# EAGLE design RxDuino_Rev4b (EAGLE 6.0)
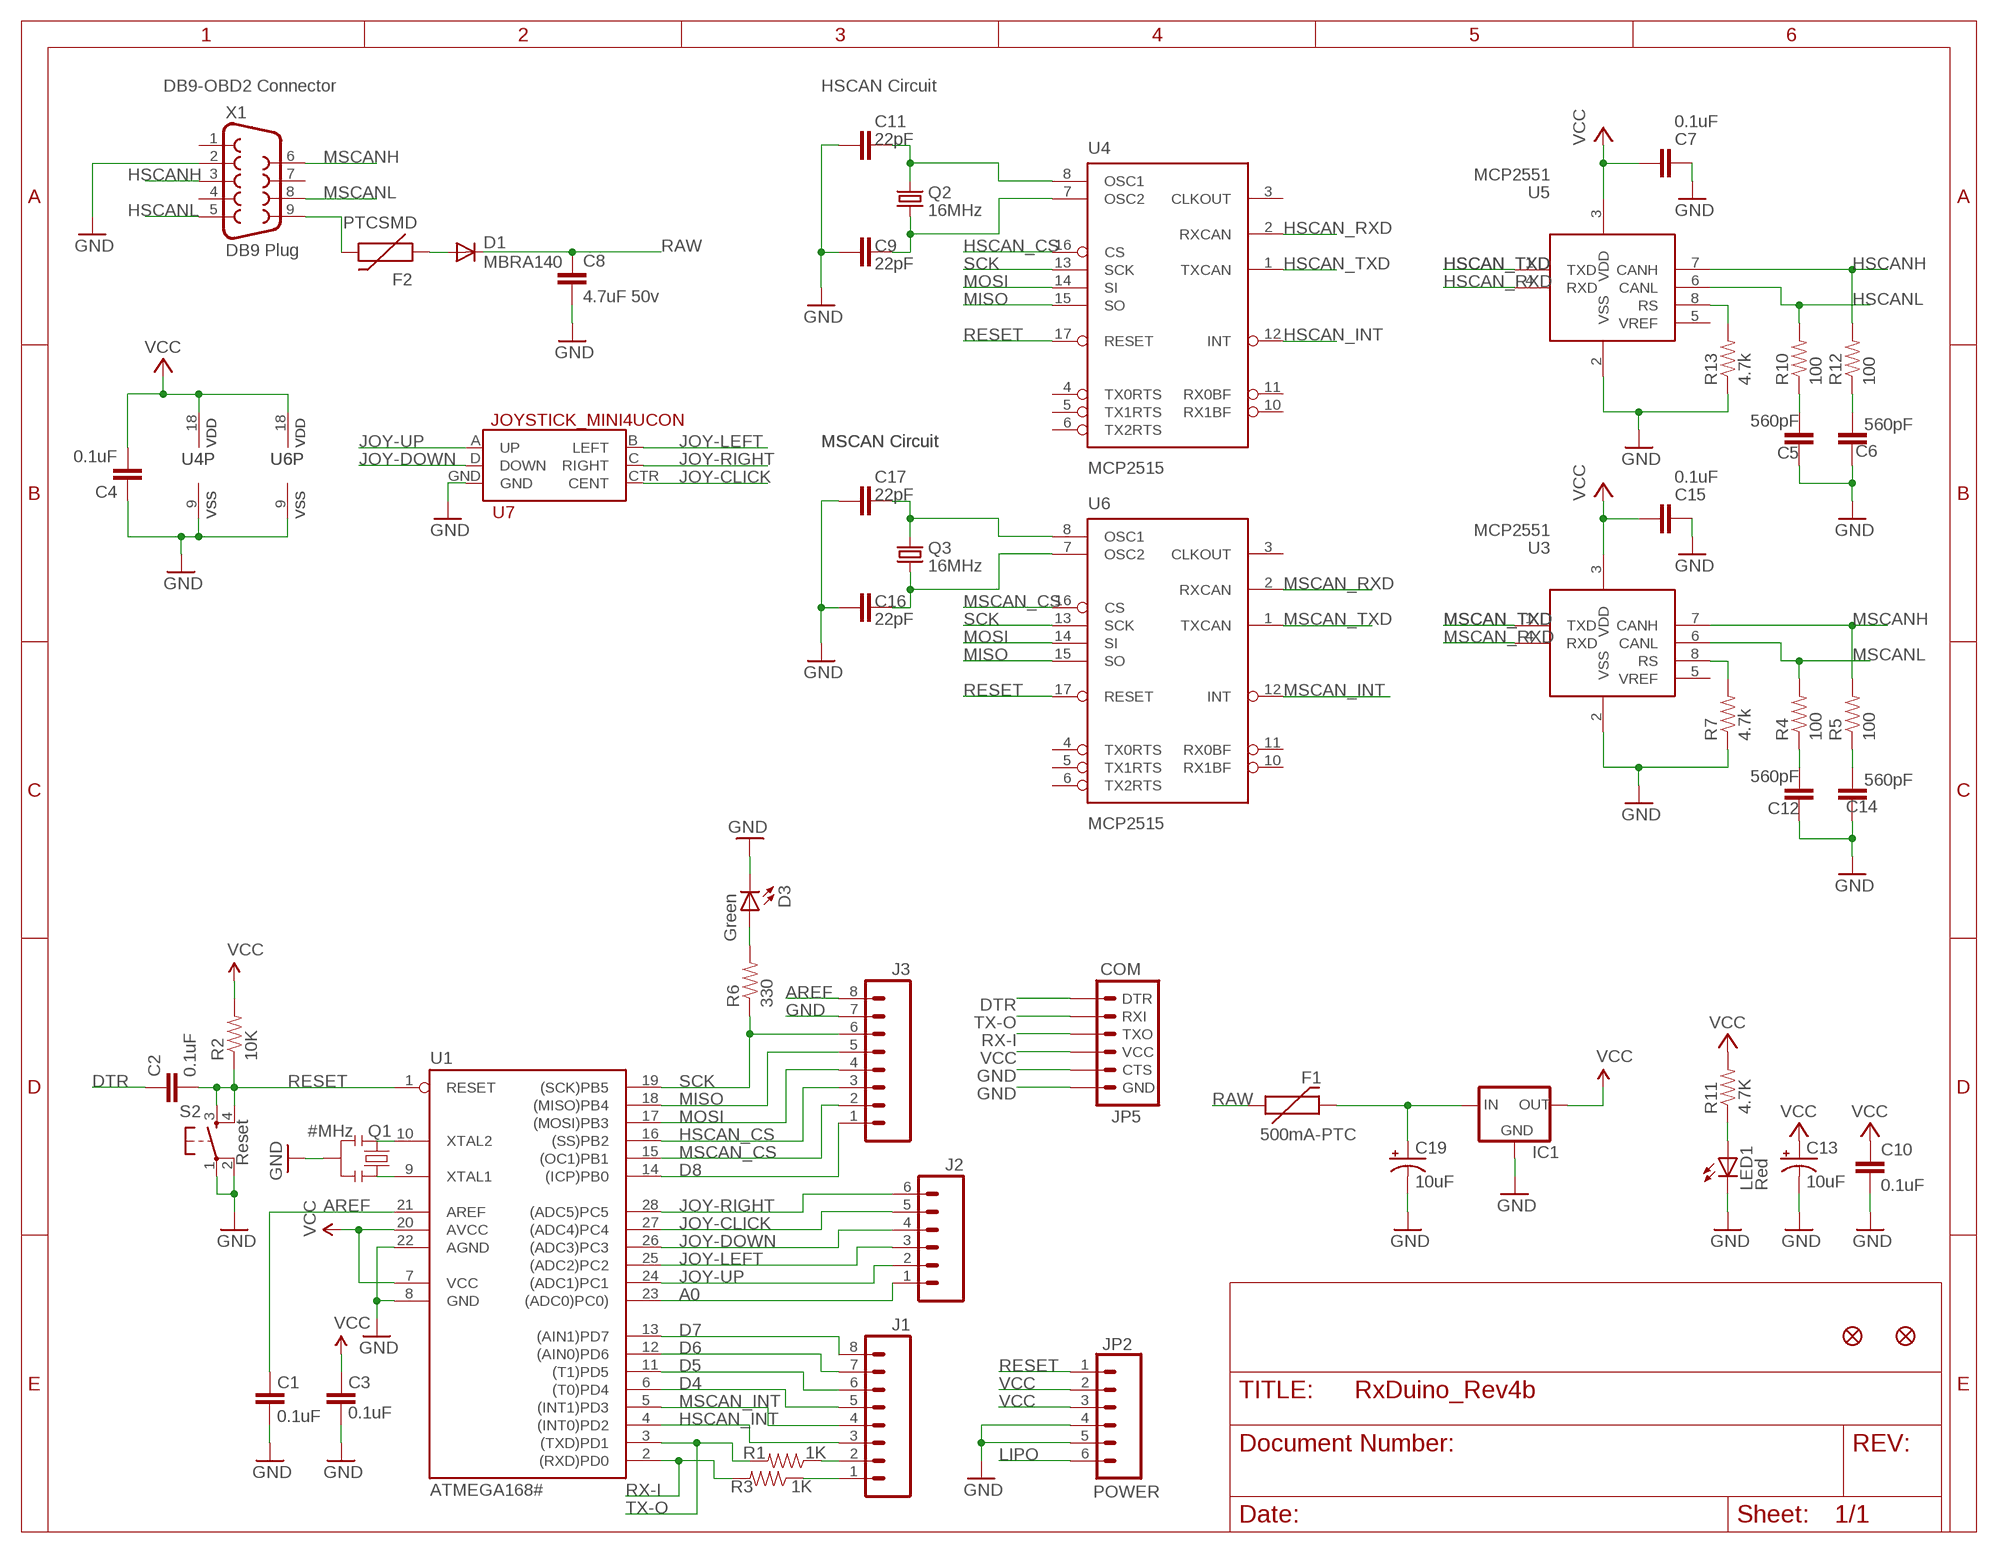
[diagram p0: schematic, sheet 1]

## Parts
C1  0.1uF  CAP1206  [1206]
C2  0.1uF  CAP1206  [1206]
C3  0.1uF  CAP1206  [1206]
C4  0.1uF  CAP1206  [1206]
C5  560pF  CAP1206  [1206]
C6  560pF  CAP1206  [1206]
C7  0.1uF  CAP1206  [1206]
C8  4.7uF 50v  CAP1206  [1206]
C9  22pF  CAP1206  [1206]
C10  0.1uF  CAP1206  [1206]
C11  22pF  CAP1206  [1206]
C12  560pF  CAP1206  [1206]
C13  10uF  CAP_POLE  [PANASONIC_E]
C14  560pF  CAP1206  [1206]
C15  0.1uF  CAP1206  [1206]
C16  22pF  CAP1206  [1206]
C17  22pF  CAP1206  [1206]
C19  10uF  CAP_POLE  [PANASONIC_E]
D1  MBRA140  DIODESMA  [SMA-DIODE]
D3  Green  LED1206  [LED-1206]
F1  500mA-PTC  PTCSMD  [PTC-1206]
F2  PTCSMD  [PTC-1206]
IC1  V_REG_78XX-TO-220  [TO-220-ALT]
J1  M08  [1X08]
J2  M06SIP  [1X06]
J3  M08  [1X08]
JP2  POWER  M06SIP  [1X06]
JP5  COM  ARDUINO_SERIAL_PROGRAMPTH  [1X06]
LED1  Red  LED1206  [LED-1206]
Q1  #MHz  RESONATORPTH  [RESONATOR-PTH]
Q2  16MHz  CRYSTALHC49US  [HC49US]
Q3  16MHz  CRYSTALHC49US  [HC49US]
R1  1K  RESISTOR1206  [1206]
R2  10K  RESISTOR1206  [1206]
R3  1K  RESISTOR1206  [1206]
R4  100  RESISTOR1206  [1206]
R5  100  RESISTOR1206  [1206]
R6  330  RESISTOR1206  [1206]
R7  4.7k  RESISTOR1206  [1206]
R10  100  RESISTOR1206  [1206]
R11  4.7K  RESISTOR1206  [1206]
R12  100  RESISTOR1206  [1206]
R13  4.7k  RESISTOR1206  [1206]
S2  Reset  TAC_SWITCHSND  [TACTILE_SWITCH_SMD]
U1  ATMEGA168#  AT90S4433P  [DIL28-3]
U3  MCP2551  [SO-08M]
U4  MCP2515  MCP2510SO  [SO-18W]
U5  MCP2551  [SO-08M]
U6  MCP2515  MCP2510SO  [SO-18W]
U7  JOYSTICK_MINI4UCON  [JOYSTICK_MINI]
U$2  FIDUCIAL1X2  [FIDUCIAL-1X2]
U$4  FIDUCIAL1X2  [FIDUCIAL-1X2]
X1  DB9 Plug  DB9MALE  [DB9_MALE]

## Nets
A0: J2.1 U1.23((ADC0)PC0))
AREF: C1.2 J3.8 U1.21(AREF)
D1R: D1.A F2.1
D3N: D3.A R6.2
D4: J1.5 U1.6((T0)PD4)
D5: J1.6 U1.11((T1)PD5)
D6: J1.7 U1.12((AIN0)PD6)
D7: J1.8 U1.13((AIN1)PD7)
D8: J3.1 U1.14((ICP)PB0)
DTR: C2.1 JP5.1(DTR)
GND [vcc]: C1.1 C3.1 C4.1 C5.1 C6.1 C7.1 C8.2 C9.1 C10.2 C11.1 C12.1 C13.- C14.1 C15.1 C16.1 C17.1 C19.- D3.C IC1.GND J3.7 JP2.4 JP2.5 JP5.5(CTS) JP5.6(GND) LED1.C Q1.2 R7.1 R13.1 S2.1 S2.2 U1.8(GND) U1.22(AGND) U3.2(VSS) U4.9(VSS) U5.2(VSS) U6.9(VSS) U7.GND X1.2
HSCAN_CS: J3.3 U1.16((SS)PB2) U4.16(CS)
HSCAN_INT: J1.3 U1.4((INT0)PD2) U4.12(INT)
HSCAN_RXD: U4.2(RXCAN) U5.4(RXD)
HSCAN_TXD: U4.1(TXCAN) U5.1(TXD)
HSCANH: R12.2 U5.7(CANH) X1.3
HSCANL: R10.2 U5.6(CANL) X1.5
HSQ1: C11.2 Q2.2 U4.8(OSC1)
HSQ2: C9.2 Q2.1 U4.7(OSC2)
HSRS: R13.2 U5.8(RS)
JOY-CLICK: J2.5 U1.27((ADC4)PC4) U7.CTR(CENT)
JOY-DOWN: J2.4 U1.26((ADC3)PC3) U7.D(DOWN)
JOY-LEFT: J2.3 U1.25((ADC2)PC2) U7.B(LEFT)
JOY-RIGHT: J2.6 U1.28((ADC5)PC5) U7.C(RIGHT)
JOY-UP: J2.2 U1.24((ADC1)PC1) U7.A(UP)
LIPO: JP2.6
MEGAP9: Q1.3 U1.9(XTAL1)
MEGAP10: Q1.1 U1.10(XTAL2)
MISO: J3.5 U1.18((MISO)PB4) U4.15(SO) U6.15(SO)
MOSI: J3.4 U1.17((MOSI)PB3) U4.14(SI) U6.14(SI)
MSCAN_CS: J3.2 U1.15((OC1)PB1) U6.16(CS)
MSCAN_INT: J1.4 U1.5((INT1)PD3) U6.12(INT)
MSCAN_RXD: U3.4(RXD) U6.2(RXCAN)
MSCAN_TXD: U3.1(TXD) U6.1(TXCAN)
MSCANH: R5.2 U3.7(CANH) X1.6
MSCANL: R4.2 U3.6(CANL) X1.8
MSQ1: C17.2 Q3.2 U6.8(OSC1)
MSQ2: C16.2 Q3.1 U6.7(OSC2)
MSRS: R7.2 U3.8(RS)
PTCN: F2.2 X1.9
R4N: C12.2 R4.1
R5N: C14.2 R5.1
R10N: C5.2 R10.1
R11N: LED1.A R11.1
R12N: C6.2 R12.1
RAW [vcc]: C8.1 D1.C F1.1
RAWN: C19.+ F1.2 IC1.IN
RESET: C2.2 JP2.1 R2.1 S2.3 S2.4 U1.1(RESET) U4.17(RESET) U6.17(RESET)
RX-I: JP5.3(TXO) R3.2 U1.2((RXD)PD0)
RX-IP: J1.2 R1.1
SCK: J3.6 R6.1 U1.19((SCK)PB5) U4.13(SCK) U6.13(SCK)
TX-O: JP5.2(RXI) R1.2 U1.3((TXD)PD1)
TX-OP: J1.1 R3.1
VCC [vcc]: C3.2 C4.2 C7.2 C10.1 C13.+ C15.2 IC1.OUT JP2.2 JP2.3 JP5.4(VCC) R2.2 R11.2 U1.7(VCC) U1.20(AVCC) U3.3(VDD) U4.18(VDD) U5.3(VDD) U6.18(VDD)
Unconnected: U3.5(VREF) U4.3(CLKOUT) U4.4(TX0RTS) U4.5(TX1RTS) U4.6(TX2RTS) U4.10(RX1BF) U4.11(RX0BF) U5.5(VREF) U6.3(CLKOUT) U6.4(TX0RTS) U6.5(TX1RTS) U6.6(TX2RTS) U6.10(RX1BF) U6.11(RX0BF) X1.1 X1.4 X1.7

## Notes on the sheet
- DB9-OBD2 Connector | HSCAN Circuit
- MSCAN Circuit | MSCAN Circuit

## Library data of the parts
C1-C12 C14-C17 = SparkFun:CAP: Capacitor Standard 0603 ceramic capacitor, and 0.1" leaded capacitor.
C13 C19 = SparkFun:CAP_POL: Capacitor Polarized These are standard SMD and PTH capacitors. Normally 10uF, 47uF, and 100uF in electrolytic and tantalum varieties. Always verify the external diameter of the through hole cap, it varies with capacity, voltage, and manufacturer. The EIA devices should be standard.
D1 = SparkFun:DIODE: Diode These are standard reverse protection diodes and small signal diodes. SMA package can handle up to about 1A. SOD-323 can handle about 200mA. What the SOD-323 package when ordering, there are some mfgs out there that are 5-pin packages.
D3 LED1 = SparkFun:LED: LEDs Standard schematic elements and footprints for 5mm, 3mm, 1206, and 0603 sized LEDs. 5mm - Spark Fun Electronics SKU : COM-00529 (and others)
F1 F2 = SparkFun:PTC: Resettable Fuse PTC Resettable Fuse. Spark Fun Electronics SKU : COM-08357
IC1 = SparkFun:V_REG_78XX: Voltage Regulator Standard 7805 5V regulator. IGO (Input Ground Output). Spark Fun Electronics SKU : COM-00107
J1 J3 = SparkFun:M08: Header 8 Standard 8-pin 0.1" header. Use with straight break away headers (SKU : PRT-00116), right angle break away headers (PRT-00553), swiss pins (PRT-00743), machine pins (PRT-00117), and female headers (PRT-00115).
J2 JP2 = SparkFun:M06: Header 6 Standard 6-pin 0.1" header. Use with straight break away headers (SKU : PRT-00116), right angle break away headers (PRT-00553), swiss pins (PRT-00743), machine pins (PRT-00117), and female headers (PRT-00115). Molex polarized connector foot print use with SKU : PRT-08094 with associated crimp pins and housings.
JP5 = SparkFun:ARDUINO_SERIAL_PROGRAM
Q1 = SparkFun:RESONATOR: Resonator Small SMD resonator. This is the itty bitty 10/20MHz resonators with built in caps. CSTCE10M0G55 and CSTCE20M0V53. Footprint has been reviewed closely but hasn't been tested yet.
Q2 Q3 = SparkFun:CRYSTAL: Crystals Various standard crystals. Proven footprints. Spark Fun Electronics SKU : COM-00534
R1-R7 R10-R13 = SparkFun:RESISTOR: Resistor Basic schematic elements and footprints for 0603, 1206, and PTH resistors.
S2 = SparkFun:TAC_SWITCH: Momentary Switch Button commonly used for reset or general input. Spark Fun Electronics SKU : COM-00097
U1 = atmel:AT90S4433: MICROCONTROLLER 4 Kbytes FLASH 128 bytes SRAM 256 bytes EEPROM UART 6-channel 10 bit ADC
U3 U5 = skpang_lib:MCP2551
U4 U6 = microchip_can:MCP2510
U7 = SparkFun:JOYSTICK_MINI
U$2 U$4 = SparkFun:FIDUCIAL: Fiducial Alignment Points Various fiducial points for machine vision alignment.
X1 = SparkFun:DB9: DB9 Connector Standard DB9 (D-Sub 9) serial connector. Can be used for CAN bus as well as RS485 and RS232. Footprint production proven. Spark Fun Electronics SKU : PRT-00429

## Net classes
1 vcc: width 0.203 mm

## Board
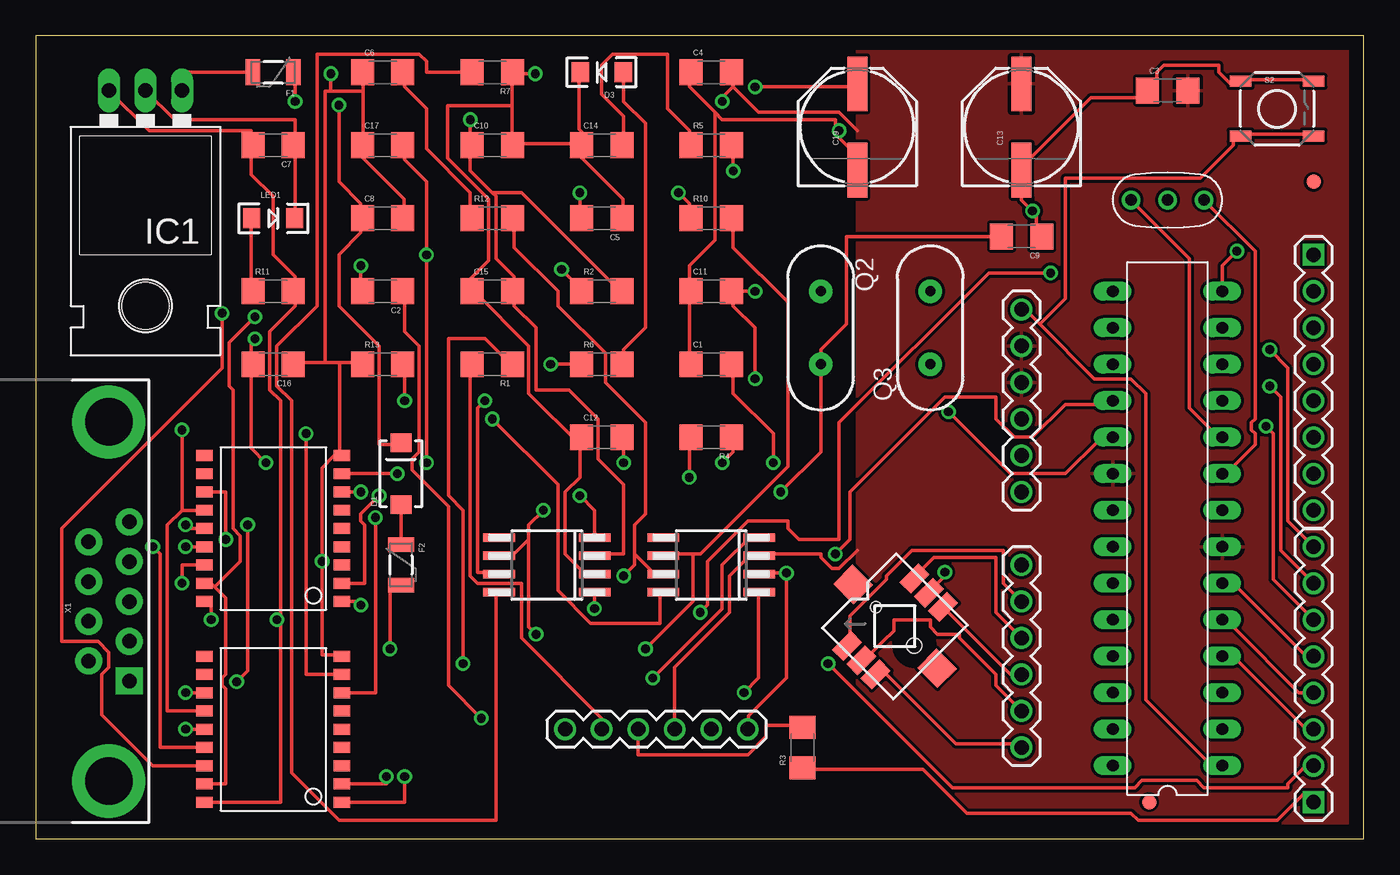
[diagram p1: board, top side]
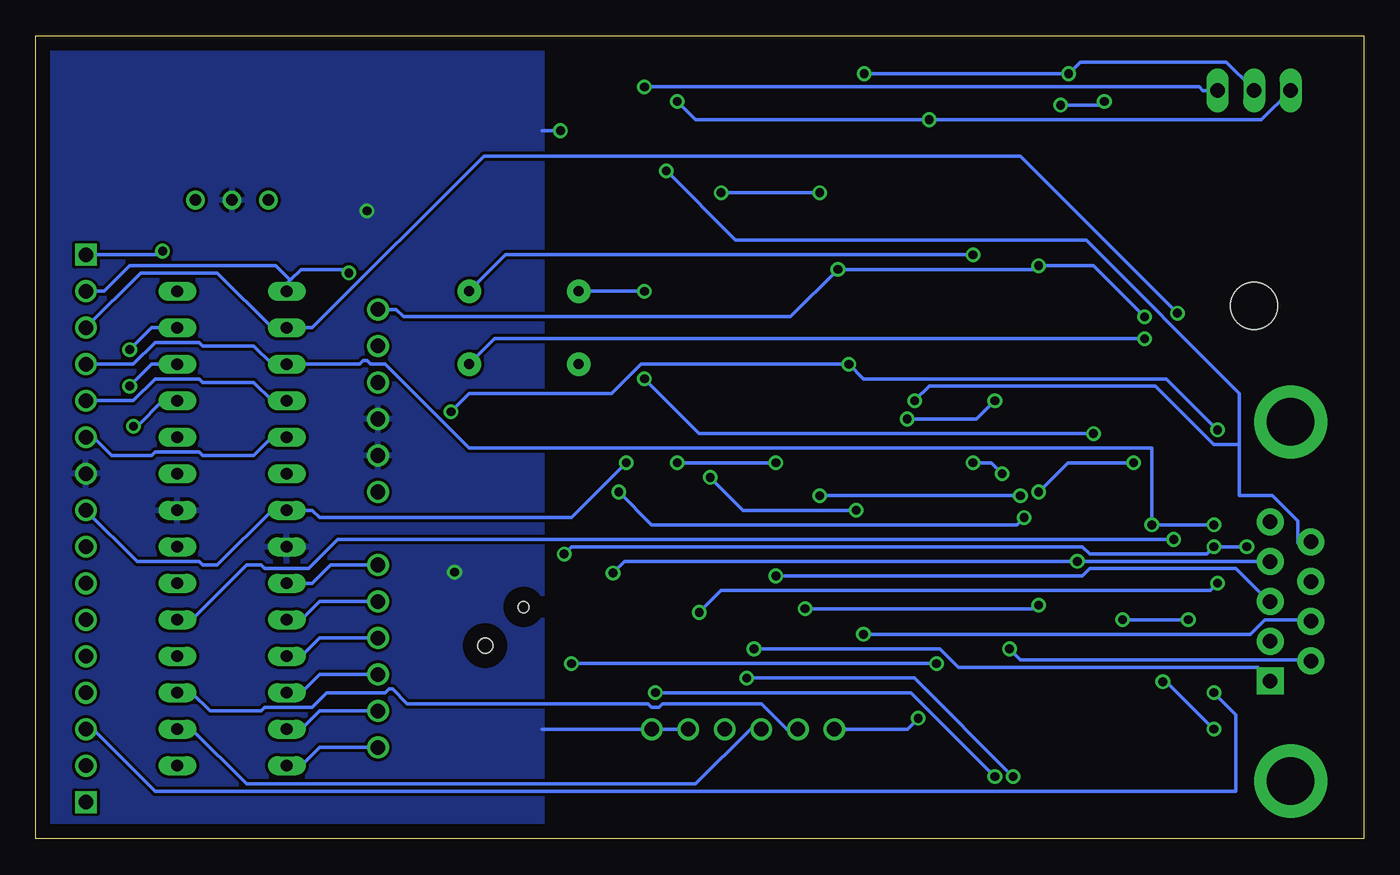
[diagram p2: board, bottom side, seen from below]

Size 92.38 x 55.87 mm. Coordinates in mm from the lower left corner, seen from the top.
Outline: 0,0 92.38,0 92.38,55.87 0,55.87 0,0
Copper layers (1*16): Top 0.035mm / dielectric 1.5mm / Bottom 0.035mm
Design rules: minimum track width 10mil, minimum drill 24mil, track to track 8mil, track to pad 8mil, pad to pad 8mil, via to via 8mil, smd to smd 8mil, copper to edge 40mil, drill to drill 8mil, minimum pad ring 10mil, minimum via ring 8mil, stop-mask expansion 4mil, vias tented up to drill 0mil, thermal gap 10mil

### Footprints (pad centres in the part's own frame; a part is rotated, then mirrored left to right if it is on the bottom)
1206 = smd 1.6 x 1.8: 1 -1.4,0; 2 1.4,0
PANASONIC_E = smd 3.8 x 1.4: + 3,0; - -3,0
SMA-DIODE = smd 1.27 x 1.47: A -2.15,0; C 2.15,0
LED-1206 = smd 1.2 x 1.4: A -1.5,0; C 1.5,0
PTC-1206 = smd 1 x 1.8: 1 -1.4,0; 2 1.4,0
TO-220-ALT = drill 1.016 long: GND 0,-3.81; IN -2.54,-3.81; OUT 2.54,-3.81 | hole 3.302: 0,11.176
1X08 = drill 1.016 square: 1 0,0 | drill 1.016: 2 2.54,0; 3 5.08,0; 4 7.62,0; 5 10.16,0; 6 12.7,0; 7 15.24,0; 8 17.78,0
1X06 = drill 1.016: 1 0,0; 2 2.54,0; 3 5.08,0; 4 7.62,0; 5 10.16,0; 6 12.7,0
RESONATOR-PTH = drill 0.8: 1 -2.54,0; 2 0,0; 3 2.54,0
HC49US = drill 0.7 pad 1.651: 1 -2.54,0; 2 2.54,0
TACTILE_SWITCH_SMD = smd 1.524 x 0.762: 1 -2.54,1.905; 2 2.54,1.905; 3 -2.54,-1.905; 4 2.54,-1.905
DIL28-3 = drill 0.813 long: 1 -16.51,-3.81; 2 -13.97,-3.81; 3 -11.43,-3.81; 4 -8.89,-3.81; 5 -6.35,-3.81; 6 -3.81,-3.81; 7 -1.27,-3.81; 8 1.27,-3.81; 9 3.81,-3.81; 10 6.35,-3.81; 11 8.89,-3.81; 12 11.43,-3.81; 13 13.97,-3.81; 14 16.51,-3.81; 15 16.51,3.81; 16 13.97,3.81; 17 11.43,3.81; 18 8.89,3.81; 19 6.35,3.81; 20 3.81,3.81; 21 1.27,3.81; 22 -1.27,3.81; 23 -3.81,3.81; 24 -6.35,3.81; 25 -8.89,3.81; 26 -11.43,3.81; 27 -13.97,3.81; 28 -16.51,3.81
SO-08M = smd 0.6 x 2.2: 1 -1.905,-3.33; 2 -0.635,-3.33; 3 0.635,-3.33; 4 1.905,-3.33; 5 1.905,3.33; 6 0.635,3.33; 7 -0.635,3.33; 8 -1.905,3.33
SO-18W = smd 0.762 x 1.143: 1 -5.08,-4.788; 2 -3.81,-4.788; 3 -2.54,-4.788; 4 -1.27,-4.788; 5 0,-4.788; 6 1.27,-4.788; 7 2.54,-4.788; 8 3.81,-4.788; 9 5.08,-4.788; 10 5.08,4.788; 11 3.81,4.788; 12 2.54,4.788; 13 1.27,4.788; 14 0,4.788; 15 -1.27,4.788; 16 -2.54,4.788; 17 -3.81,4.788; 18 -5.08,4.788
JOYSTICK_MINI = smd 1.85 x 1.1: A 0,2.8; B 6.65,2.8; C 0,0; CTR 0,1.4; D 6.65,0; GND 6.65,1.4 | smd 1.9 x 2: NC 3.325,5.53; NC@0 3.33,-2.72 | hole 0.75: 3.34,3.295 | hole 1.05: 3.325,-0.5
FIDUCIAL-1X2 = smd 1 x 1: 1 0,0
DB9_MALE = drill 1.016 pad 1.88: 1 5.54,-1.42; 2 2.77,-1.42; 3 0,-1.42; 4 -2.77,-1.42; 6 4.15,1.42; 7 1.38,1.42; 8 -1.38,1.42; 9 -4.15,1.42 | drill 1.016 pad 1.88 square: 5 -5.54,-1.42 | drill 3.302 pad 5.08: G1 -12.5,0; G2 12.5,0

### Placement (x,y rotation side)
C1  46.99,33.02 0 top
C2  24.13,38.1 180 top
C3  78.74,52.07 0 top
C4  46.99,53.34 0 top
C5  39.37,43.18 180 top
C6  24.13,53.34 0 top
C7  16.51,48.26 180 top
C8  24.13,43.18 0 top
C9  68.58,41.91 180 top
C10  31.75,48.26 0 top
C11  46.99,38.1 0 top
C12  39.37,27.94 0 top
C13  68.58,49.53 90 top
C14  39.37,48.26 0 top
C15  31.75,38.1 0 top
C16  16.51,33.02 180 top
C17  24.13,48.26 0 top
C19  57.15,49.53 90 top
D1  25.4,25.4 90 top
D3  39.37,53.34 180 top
F1  16.51,53.34 180 top
F2  25.4,19.05 270 top
IC1  7.62,48.26 180 top
J1  88.9,2.54 90 top
J2  68.58,19.05 270 top
J3  88.9,40.64 270 top
JP2  68.58,36.83 270 top
JP5  36.83,7.62 0 top
LED1  16.51,43.18 0 top
Q1  78.74,44.45 0 top
Q2  54.61,35.56 90 top
Q3  62.23,35.56 90 top
R1  31.75,33.02 180 top
R2  39.37,38.1 0 top
R3  53.34,6.35 90 top
R4  46.99,27.94 180 top
R5  46.99,48.26 0 top
R6  39.37,33.02 0 top
R7  31.75,53.34 180 top
R10  46.99,43.18 0 top
R11  16.51,38.1 0 top
R12  31.75,43.18 0 top
R13  24.13,33.02 0 top
S2  86.36,50.8 0 top
U1  78.74,21.59 90 top
U3  35.56,19.05 90 top
U4  16.51,7.62 90 top
U5  46.99,19.05 90 top
U6  16.51,21.59 90 top
U7  58.42,11.43 45 top
U$2  77.47,2.54 0 top
U$4  88.9,45.72 0 top
X1  5.08,16.51 90 top

### Tracks (layer width: path | path; a pad name or v marks a point on that pad's centre or on a via)
A0
  Bottom 0.254: U1.23 73.15,17.78 71.88,19.05 J2.1
AREF  (via drill 0.61)
  Top 0.254: v51.31,26.16 51.31,28.19 48.51,30.99 48.51,33.02 C1.2
  Bottom 0.254: v51.31,26.16 55.12,22.35 72.64,22.35 73.15,22.86 U1.21 75.95,22.86 79.76,19.05 80.77,19.05 81.03,19.3 85.34,19.3 J3.8
D1R
  Top 0.254: D1.A 25.4,23.11 25.4,20.57 F2.1
D3N
  Top 0.254: D3.A 40.89,53.34 40.89,51.31 42.42,49.78 42.42,35.56 40.89,34.04 40.89,33.02 R6.2
D4
  Top 0.254: U1.6 83.57,17.78 83.57,17.53 88.65,12.45 88.9,12.45 J1.5
D5  (via drill 0.61)
  Top 0.254: v85.6,28.7 86.11,28.19 86.11,18.03 J1.6
  Bottom 0.254: U1.11 83.57,30.48 85.34,28.7 v85.6,28.7
D6  (via drill 0.61)
  Top 0.254: v85.85,31.5 86.61,30.73 86.61,20.07 J1.7
  Bottom 0.254: U1.12 84.33,33.02 v85.85,31.5
D7  (via drill 0.61)
  Top 0.254: v85.85,34.04 87.12,32.77 87.12,22.1 J1.8
  Bottom 0.254: U1.13 84.33,35.56 v85.85,34.04
D8  (via drill 0.61)
  Top 0.254: U1.14 82.55,39.88 v83.57,40.89
  Bottom 0.254: v83.57,40.89 83.82,40.64 J3.1
DTR  (via drill 0.61)
  Top 0.254: v30.99,8.38 28.7,10.67 28.7,23.11 26.16,25.65 26.16,26.42 26.67,26.92 26.67,34.29 25.65,35.31 25.65,38.1 C2.1
  Bottom 0.254: v30.99,8.38 31.75,7.62 JP5.1
GND  (via drill 0.61)
  Top 0.254: 18.03,48.26 18.03,43.18 LED1.C | 18.03,48.26 C7.1 18.03,48.26 | IC1.GND 9.65,50.04 18.03,50.04 18.03,48.26 | 37.85,27.43 37.85,25.15 36.83,24.13 36.83,19.81 38.1,18.54 38.86,18.54 U3.2 | 37.85,27.43 37.85,27.94 C12.1 37.85,27.43 | 37.85,27.43 34.29,30.99 34.29,34.29 30.48,38.1 C15.1 30.28,38.2 30.28,39.01 31.5,40.23 31.5,44.5 28.65,47.35 28.65,51 33.12,51 | 45.47,38.1 45.47,33.02 C1.1 | 45.47,38.1 C11.1 45.47,38.1 | 47.24,50.55 47.75,50.04 55.63,50.04 55.63,49.28 | 47.24,50.55 45.47,52.32 45.47,53.34 C4.1 | 55.63,49.28 55.63,49.02 57.15,47.5 57.15,46.74 C19.- | 45.47,38.1 45.47,39.88 47.24,41.66 47.24,50.55 | C9.1 69.85,41.91 69.6,42.16 69.6,43.43 v69.34,43.69 68.58,44.45 68.58,46.48 C13.- 68.58,46.74 73.41,51.56 77.22,51.56 77.22,52.07 C3.1 77.47,52.07 77.98,52.58 77.98,53.34 78.49,53.85 82.3,53.85 82.3,53.34 83.06,52.58 83.82,52.58 S2.1 83.82,52.83 88.9,52.83 S2.2 | v63.25,18.54 63.25,18.29 62.23,17.27 U7.GND | v55.88,49.28 55.63,49.28 | 33.12,51 33.12,53.24 R7.1 33.33,53.24 v34.75,53.24 | 33.12,51 33.12,48.36 C10.2 33.33,48.36 37.8,48.36 C14.1 | D3.C 37.8,53.24 37.8,49.38 38,49.17 38,48.36 C14.1 | C5.1 40.84,43.28 40.84,44.5 38,47.35 38,48.16 C14.1 | 22.76,52.02 22.76,53.24 C6.1 | 22.76,52.02 22.76,48.36 C17.1 22.76,48.16 22.76,47.35 25.6,44.5 25.6,43.28 C8.2 | U5.2 50.39,18.49 v52.22,18.49 52.22,11.18 49.58,8.53 49.58,7.72 JP5.6 | 21.13,33.12 22.55,33.12 R13.1 | 21.13,33.12 20.12,33.12 | 20.12,33.12 18.09,33.12 C16.1 | U4.9 21.13,12.8 19.91,12.8 v19.91,19.3 19.91,25.81 20.73,26.62 21.13,26.62 U6.9 21.13,26.82 21.13,33.12 | 20.52,52.02 20.12,52.02 20.12,33.12
  Top 0.254: 20.52,52.02 22.76,52.02 | 20.52,52.02 v20.52,53.24
  Bottom 0.254: JP5.5 JP5.6 57.15,7.62 | 57.15,49.28 v55.88,49.28 | X1.2 6.5,19.3 v19.91,19.3 51.41,19.3 v52.22,18.49 | IC1.GND 7.72,52.22 9.55,54.05 19.71,54.05 v20.52,53.24 v34.75,53.24
  pour Bottom: 57.15,0 57.15,55.88 92.71,55.88 92.71,0
HSCAN_CS  (via drill 0.61)
  Top 0.254: v12.95,36.58 12.95,32.77 1.78,21.59 1.78,13.72 4.32,13.72 5.08,12.95 5.08,11.94 4.57,11.43 4.57,8.64 8.13,5.08 11.68,5.08 U4.16
  Bottom 0.254: v12.95,36.58 23.88,47.5 61.21,47.5 73.15,35.56 U1.16 75.95,35.56 79.76,39.37 85.09,39.37 J3.3
HSCAN_INT  (via drill 0.61)
  Top 0.254: v10.41,10.16 11.68,10.16 U4.12 | U1.4 83.57,12.7 83.57,12.45 88.65,7.37 88.9,7.37 J1.3
  Bottom 0.254: v10.41,10.16 8.89,8.64 8.89,3.3 84.07,3.3 88.39,7.62 J1.3
HSCAN_RXD  (via drill 0.61)
  Top 0.254: v24.38,4.32 24.38,3.81 21.34,3.81 U4.2 | v42.93,11.18 47.75,16 47.75,19.05 49.78,21.08 50.29,21.08 U5.4
  Bottom 0.254: v24.38,4.32 31.24,11.18 v42.93,11.18
HSCAN_TXD  (via drill 0.61)
  Top 0.254: v25.65,4.32 25.65,2.54 21.34,2.54 U4.1 | v49.28,10.16 50.29,11.18 50.29,17.02 U5.1
  Bottom 0.254: v25.65,4.32 31.5,10.16 v49.28,10.16
HSCANH  (via drill 0.61)
  Top 0.254: 41.66,19.81 41.66,21.84 42.42,22.61 42.42,28.96 39.62,31.75 39.62,33.78 36.32,37.08 36.32,38.1 33.27,41.15 33.27,43.18 R12.2 | 41.66,19.81 42.93,18.54 43.43,18.54 U5.7 | v40.89,18.29 41.66,19.05 41.66,19.81
  Bottom 0.254: v40.89,18.29 19.56,18.29 19.05,18.8 8.89,18.8 6.6,16.51 X1.3
HSCANL  (via drill 0.61)
  Top 0.254: 45.72,19.81 43.69,19.81 U5.6 | 45.72,19.81 46.23,19.81 52.32,25.91 52.32,37.34 48.51,41.15 48.51,43.18 R10.2 | v42.42,13.21 45.72,16.51 45.72,19.81
  Bottom 0.254: v42.42,13.21 29.46,13.21 28.19,11.94 7.37,11.94 6.6,11.18 X1.5
HSQ1  (via drill 0.61)
  Top 0.254: v18.8,28.19 18.8,11.43 21.08,11.43 U4.8 | v50.04,32 50.04,35.56 48.51,37.08 48.51,38.1 | 48.51,38.1 C11.2 48.51,38.1 | 48.51,38.1 v50.04,38.1
  Bottom 0.254: v18.8,28.19 46.23,28.19 v50.04,32 | v50.04,38.1 Q2.2
HSQ2  (via drill 0.61)
  Top 0.254: v23.62,22.35 23.62,10.16 21.34,10.16 U4.7 | v51.82,24.13 54.61,26.92 Q2.1 54.61,34.04 56.39,35.81 56.39,41.91 67.06,41.91 C9.2
  Bottom 0.254: v23.62,22.35 24.13,21.84 49.53,21.84 v51.82,24.13
HSRS  (via drill 0.61)
  Top 0.254: v25.65,30.48 25.65,33.02 R13.2 | v31.75,29.21 36.32,24.64 36.32,17.27 38.61,14.99 43.43,14.99 43.43,17.02 U5.8
  Bottom 0.254: v25.65,30.48 26.92,29.21 v31.75,29.21
JOY-CLICK
  Top 0.254: J2.5 66.8,10.67 66.8,11.43 64.26,13.97 64.26,14.22 62.74,14.22 62.23,14.73 62.23,15.24 59.69,15.24 59.69,14.48 58.93,13.72 57.66,12.45 U7.CTR
  Bottom 0.254: U1.27 73.91,7.62 72.64,8.89 J2.5
JOY-DOWN
  Top 0.254: J2.4 68.58,10.92 68.33,10.92 63.25,16 U7.D
  Bottom 0.254: U1.26 73.91,10.16 72.64,11.43 J2.4
JOY-LEFT
  Top 0.254: J2.3 66.8,15.75 66.8,19.56 62.48,19.56 61.21,18.29 U7.B
  Bottom 0.254: U1.25 73.91,12.7 72.64,13.97 J2.3
JOY-RIGHT
  Top 0.254: U7.C 59.18,11.43 64.01,6.6 68.58,6.6 J2.6
  Bottom 0.254: U1.28 73.91,5.08 72.64,6.35 J2.6
JOY-UP
  Top 0.254: J2.2 67.31,17.78 67.31,20.07 60.96,20.07 59.18,18.29 59.18,18.03 56.64,15.49 56.64,13.46 U7.A
  Bottom 0.254: U1.24 73.91,15.24 72.64,16.51 J2.2
MEGAP9
  Top 0.254: Q1.3 84.84,40.89 84.84,29.21 84.58,28.96 84.58,28.45 84.84,28.19 84.84,27.43 83.31,25.91 82.55,25.91 U1.9
MEGAP10
  Top 0.254: Q1.1 80.26,40.39 80.26,29.97 81.79,28.45 82.55,28.45 U1.10
MISO  (via drill 0.61)
  Top 0.254: v8.13,20.32 8.64,19.81 8.64,6.35 11.68,6.35 U4.15 | v10.41,20.32 11.68,20.32 U6.15 | v55.63,19.81 56.64,20.83 56.64,24.13 63.25,30.73 66.8,30.73 66.8,29.21 68.07,27.94 69.34,27.94 71.63,30.23 74.93,30.23 U1.18
  Bottom 0.254: v8.13,20.32 v10.41,20.32 10.92,19.81 19.05,19.81 19.56,20.32 55.12,20.32 v55.63,19.81 | U1.18 75.95,30.48 77.22,31.75 80.77,31.75 81.03,32 84.07,32 85.6,30.48 J3.5
MOSI  (via drill 0.61)
  Top 0.254: v10.41,7.62 11.68,7.62 U4.14 | v13.97,10.92 14.73,11.68 v14.73,21.84 | v10.41,21.84 10.67,21.59 11.68,21.59 U6.14
  Bottom 0.254: v10.41,7.62 13.72,10.92 v13.97,10.92 | v10.41,21.84 v14.73,21.84 14.73,27.18 62.23,27.18 68.07,33.02 69.09,33.02 69.34,33.27 69.6,33.27 69.85,33.02 U1.17 75.95,33.02 77.22,34.29 80.77,34.29 81.03,34.54 84.07,34.54 85.6,33.02 J3.4
MSCAN_CS  (via drill 0.61)
  Top 0.254: v10.16,17.78 10.16,19.05 11.68,19.05 U6.16 | v46.23,15.75 46.74,16.26 46.74,19.3 49.53,22.1 52.32,22.1 52.32,21.59 53.09,20.83 55.88,20.83 55.88,28.96 66.29,39.37 v70.61,39.37
  Bottom 0.254: v10.16,17.78 10.67,17.27 44.7,17.27 v46.23,15.75 | v70.61,39.37 70.87,39.62 73.91,39.62 74.68,38.86 | 74.68,38.86 75.18,38.35 75.18,38.1 U1.15 | J3.2 87.63,38.1 85.85,39.88 75.69,39.88 74.68,38.86
MSCAN_INT  (via drill 0.61)
  Top 0.254: v13.21,20.83 13.21,24.13 11.94,24.13 U6.12 | J1.4 87.88,10.16 83.31,14.73 82.55,14.73 U1.5
  Bottom 0.254: v13.21,20.83 71.37,20.83 73.41,18.8 76.45,18.8 76.71,19.05 77.72,19.05 81.53,15.24 U1.5
MSCAN_RXD  (via drill 0.61)
  Top 0.254: v23.88,23.88 22.61,22.61 22.61,22.1 22.86,21.84 22.86,17.78 21.34,17.78 U6.2 | v37.85,23.88 38.86,22.86 38.86,21.08 U3.4
  Bottom 0.254: v37.85,23.88 v23.88,23.88
MSCAN_TXD  (via drill 0.61)
  Top 0.254: v22.61,16.26 22.61,16.51 21.34,16.51 U6.1 | v38.86,16 38.86,17.02 U3.1
  Bottom 0.254: v22.61,16.26 22.86,16 v38.86,16
MSCANH  (via drill 0.61)
  Top 0.254: v48.51,46.48 48.51,48.26 R5.2 | v31.24,30.48 30.73,29.97 30.73,18.54 32,18.54 U3.7
  Bottom 0.254: v48.51,46.48 43.69,41.66 19.3,41.66 8.64,30.99 8.64,27.43 | 8.64,27.43 8.64,23.88 6.35,23.88 4.57,22.1 4.57,20.57 3.81,20.57 X1.6 | v31.24,30.48 30.23,31.5 14.48,31.5 10.41,27.43 8.64,27.43
MSCANL  (via drill 0.61)
  Top 0.254: v45.47,25.15 45.47,27.94 R4.2 | v35.31,22.86 34.29,21.84 34.29,20.83 | 34.29,20.83 33.27,19.81 32.26,19.81 U3.6 | v34.8,14.22 34.29,14.73 34.29,20.83
  Bottom 0.254: v45.47,25.15 43.18,22.86 v35.31,22.86 | v34.8,14.22 7.87,14.22 6.86,15.24 3.81,15.24 X1.8
MSQ1  (via drill 0.61)
  Top 0.254: v25.15,25.4 21.34,25.4 U6.8 | v27.18,26.16 v27.18,40.64 27.18,45.72 25.65,47.24 25.65,48.26 C17.2
  Bottom 0.254: v25.15,25.4 25.91,26.16 v27.18,26.16 | Q3.2 59.69,40.64 v27.18,40.64
MSQ2  (via drill 0.61)
  Top 0.254: v22.61,24.13 21.34,24.13 U6.7 | v16,26.16 14.99,27.18 14.99,33.02 | 14.99,33.02 C16.2 14.99,33.02 | v15.24,34.8 14.99,34.54 14.99,33.02
  Bottom 0.254: v22.61,24.13 20.57,26.16 v16,26.16 | Q3.1 60.45,34.8 v15.24,34.8
MSRS
  Top 0.254: R7.2 30.23,53.34 27.18,53.34 27.18,54.1 26.67,54.61 19.56,54.61 19.56,37.08 16.76,34.29 16.76,31.5 17.78,30.48 17.78,4.57 21.08,1.27 32,1.27 32,17.02 U3.8
PTCN  (via drill 0.61)
  Top 0.254: v24.64,13.21 24.64,17.53 25.4,17.53 F2.2
  Bottom 0.254: v24.64,13.21 23.88,12.45 3.81,12.45 X1.9
R4N  (via drill 0.61)
  Top 0.254: v40.89,26.16 40.89,27.94 C12.2 | v47.75,26.16 48.51,26.92 48.51,27.94 R4.1
  Bottom 0.254: v47.75,26.16 v40.89,26.16
R5N
  Top 0.254: C14.2 40.89,48.26 40.89,50.29 39.37,51.82 39.37,53.85 40.13,54.61 43.94,54.61 43.94,50.8 45.47,49.28 45.47,48.26 R5.1
R10N  (via drill 0.61)
  Top 0.254: v37.85,44.96 37.85,43.18 C5.2 | v44.7,44.96 45.47,44.2 45.47,43.18 R10.1
  Bottom 0.254: v44.7,44.96 v37.85,44.96
R11N
  Top 0.254: LED1.A 14.99,43.18 14.99,38.1 R11.1
R12N
  Top 0.254: R12.1 30.23,43.18 30.23,44.96 27.18,48.01 27.18,50.8 25.65,52.32 25.65,53.34 C6.2
RAW  (via drill 0.61)
  Top 0.254: 22.61,43.18 22.61,42.16 21.08,40.64 21.08,37.08 23.88,34.29 23.88,27.43 25.4,27.43 D1.C | 22.61,43.18 C8.1 22.61,43.18 | v18.03,51.31 18.03,53.34 F1.1 | v21.08,51.05 21.08,45.72 22.61,44.2 22.61,43.18
  Bottom 0.254: v18.03,51.31 18.29,51.05 v21.08,51.05
RAWN  (via drill 0.61)
  Top 0.254: IC1.IN 10.16,53.34 14.99,53.34 F1.2 | v50.04,52.32 57.15,52.32 C19.+
  Bottom 0.254: v50.04,52.32 11.43,52.32 11.18,52.07 IC1.IN
RESET  (via drill 0.61)
  Top 0.254: 12.45,17.53 12.19,17.78 11.94,17.78 U6.17 | 12.45,17.53 13.21,16.76 13.21,11.43 12.95,11.18 12.95,10.67 13.21,10.41 13.21,3.81 11.94,3.81 U4.17 | v22.61,39.88 22.61,38.1 C2.2 | v36.58,39.62 37.85,38.35 37.85,38.1 R2.1 | 12.45,17.53 14.22,19.3 14.22,21.08 13.72,21.59 13.72,31.24 13.46,31.5 13.46,34.54 v15.24,36.32 | 83.82,49.02 88.9,49.02 S2.4 | 83.82,49.02 S2.3 83.82,49.02 | U1.1 81.53,5.08 81.53,5.33 77.22,9.65 77.22,30.99 76.2,32 73.66,32 69.85,35.81 | 69.85,35.81 69.09,36.58 68.58,36.58 JP2.1 | 83.82,49.02 83.31,49.02 83.31,48.26 81.03,45.97 71.63,45.97 71.63,37.59 69.85,35.81
  Bottom 0.254: v15.24,36.32 18.8,39.88 v22.61,39.88 22.86,39.62 v36.58,39.62 39.88,36.32 66.8,36.32 67.31,36.83 JP2.1
RX-I
  Top 0.254: JP5.3 41.91,5.84 49.53,5.84 50.8,7.11 50.8,7.87 53.34,7.87 R3.2
  Bottom 0.254: U1.2 81.53,7.62 77.72,3.81 46.48,3.81 42.67,7.62 JP5.3
RX-IP  (via drill 0.61)
  Top 0.254: v29.72,12.19 29.72,22.86 28.7,23.88 28.7,34.8 31.24,34.8 33.02,33.02 R1.1 | v55.12,12.19 63.75,3.56 76.45,3.56 76.96,4.06 80.77,4.06 81.28,3.56 87.12,3.56 87.12,3.81 88.65,5.33 88.9,5.33 J1.2
  Bottom 0.254: v55.12,12.19 v29.72,12.19
SCK  (via drill 0.61)
  Top 0.254: 10.16,22.86 9.14,21.84 9.14,8.89 11.68,8.89 U4.13 | 10.16,22.86 11.68,22.86 U6.13 | v35.81,33.02 37.85,33.02 R6.1 | 10.16,22.86 v10.16,28.45 | U1.19 73.91,27.94 73.91,27.69 71.63,25.4 67.82,25.4 v63.5,29.72
  Bottom 0.254: U1.19 75.95,27.94 77.22,26.67 80.77,26.67 81.03,26.92 84.07,26.92 84.33,26.67 87.12,26.67 88.39,27.94 J3.6 | v10.16,28.45 13.72,32 34.8,32 v35.81,33.02 50.29,33.02 52.32,30.99 62.23,30.99 v63.5,29.72
TX-O
  Top 0.254: JP5.2 39.37,8.38 33.78,13.97 33.78,17.78 30.73,17.78 30.23,18.29 30.23,33.02 R1.2
  Bottom 0.254: U1.3 81.53,10.16 80.26,8.89 76.71,8.89 76.45,9.14 73.15,9.14 72.14,10.16 68.07,10.16 67.82,10.41 67.56,10.41 66.55,9.4 49.78,9.4 49.53,9.14 49.02,9.14 48.77,9.4 41.91,9.4 40.13,7.62 JP5.2
TX-OP
  Top 0.254: J1.1 88.9,3.05 88.14,3.05 86.36,1.27 76.71,1.27 76.2,1.78 64.77,1.78 61.72,4.83 53.34,4.83 R3.1
VCC  (via drill 0.61)
  Top 0.254: 48.51,52.32 48.51,53.34 C4.2 | 48.51,52.32 50.29,50.55 55.88,50.55 57.15,49.28 | 57.15,20.07 55.88,18.8 55.37,18.8 54.61,19.56 54.61,19.81 50.55,19.81 U5.3 50.29,19.81 49.78,19.81 48.26,18.29 48.26,15.75 44.45,11.94 JP5.4 | 30.23,48.26 30.23,46.48 31.75,44.96 | 31.75,44.96 32,44.7 32,40.39 33.27,39.12 33.27,38.1 | 30.23,48.26 C10.1 30.23,48.26 | 33.27,38.1 C15.2 33.27,38.1 | 31.75,44.96 33.78,44.96 40.64,38.1 R2.2 | 33.27,38.1 33.27,37.08 34.8,35.56 34.8,31.24 37.08,31.24 39.12,29.21 39.12,26.42 40.89,24.64 40.89,19.81 39.12,19.81 U3.3 | 17.02,15.24 17.02,30.48 16.26,31.24 16.26,35.31 18.03,37.08 18.03,38.1 | 17.02,15.24 17.02,2.54 11.94,2.54 U4.18 | 18.03,38.1 R11.2 18.03,38.1 | v12.19,15.24 12.19,16.51 11.94,16.51 U6.18 | 17.02,15.24 v16.76,15.24 | 14.99,48.26 14.99,46.23 16.51,44.7 16.51,40.64 18.03,39.12 18.03,38.1 | 14.99,48.26 C7.2 14.99,48.26 | IC1.OUT 7.87,49.28 14.99,49.28 14.99,48.26 | v30.23,50.04 30.23,48.26 | 48.51,52.32 47.75,51.56 v47.75,51.31
  Bottom 0.254: v16.76,15.24 v12.19,15.24 | IC1.OUT 7.11,50.04 v30.23,50.04 46.48,50.04 v47.75,51.31
  pour Top: 57.15,55.88 92.71,55.88 92.71,0 57.15,0

### Text on the board
tOrigins: D8 | RESET | VCC | VCC | GND | Power | GND | GND | AREF | R | D7 | U | D | Comm | L | DTR | TX | RX | VCC | GND | GND | Digital | D0 | RxDUINO | P.Sorornejad, 3/12 Rev 1.4